# EasyEDA schematic PAPR_STM32F030F4_V1.json
TITLE: PAPR STM32F030F4; REV: 1.0; Date: 2020-04-01; Sheet: 1/1; Drawn By: Márk Péter Vargha; Company: NowTechnologies Ltd
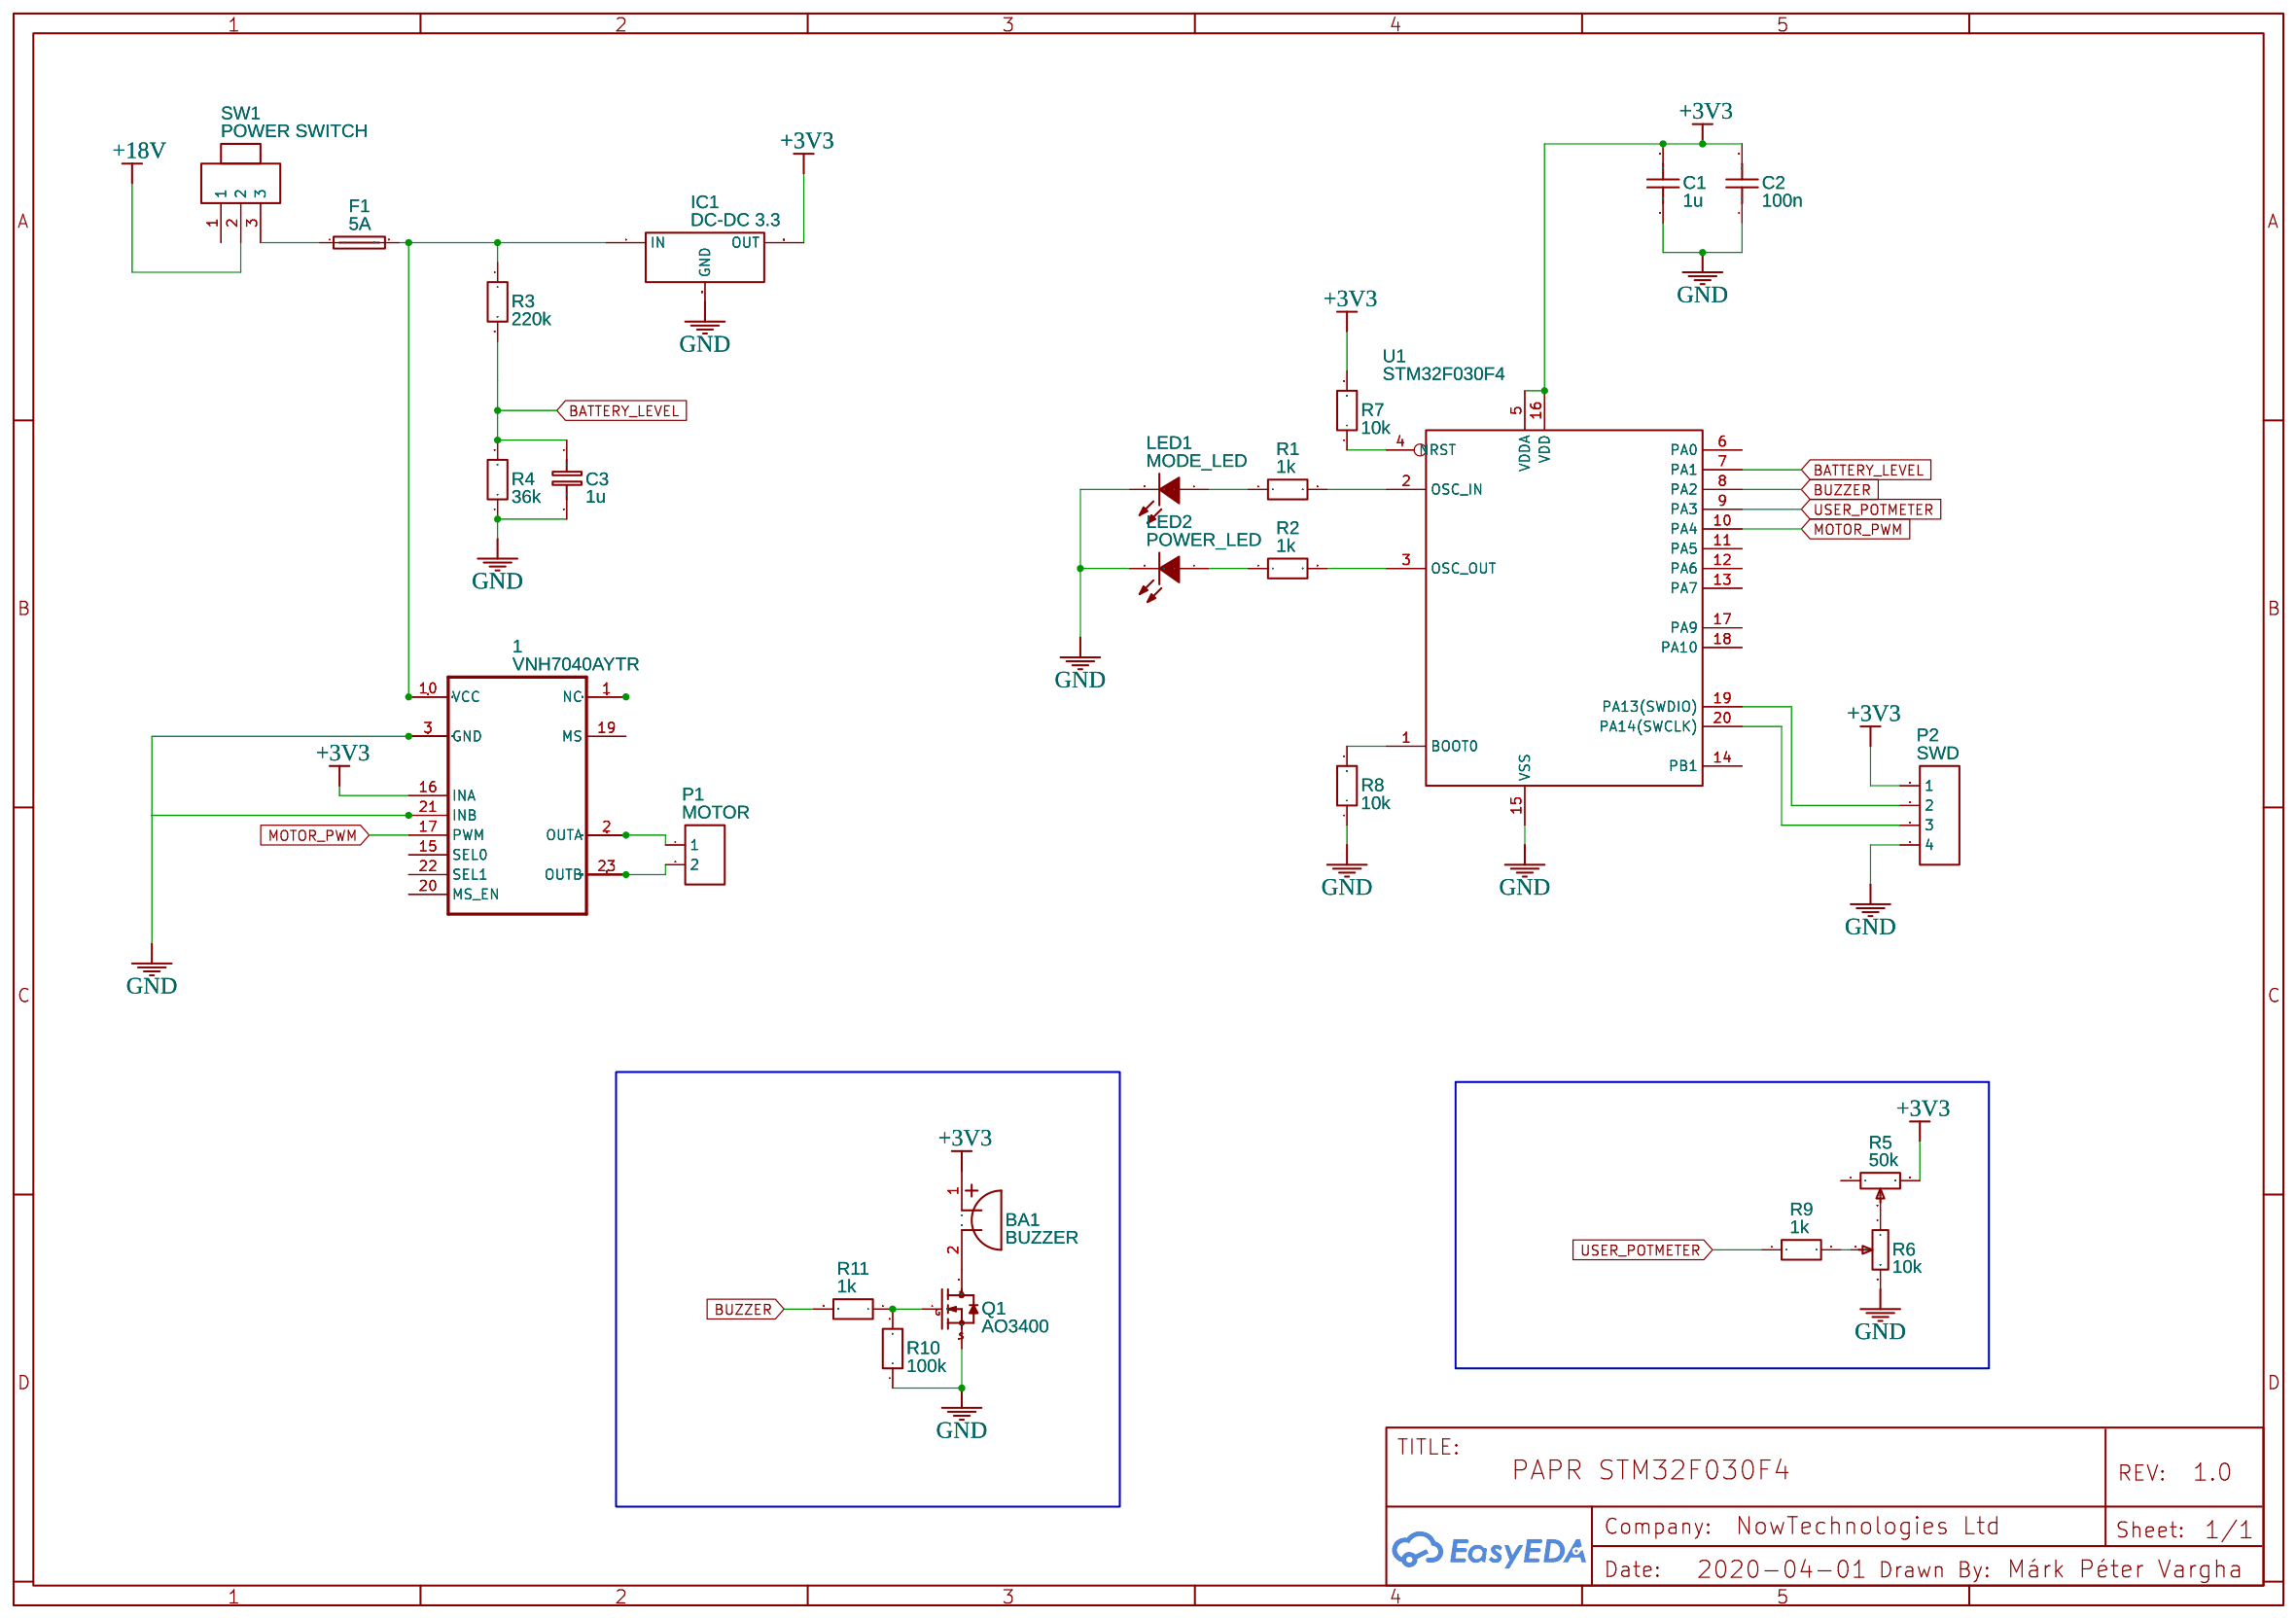
[diagram p0: schematic sheet]

## Parts
1  VNH7040AYTR  [POWERSSO-36]
BA1  BUZZER  [BEEPER_HC0905F_9.5X4.0MM]
C1  1u  [RAD-0.1]
C2  100n  [RAD-0.1]
C3  1u  [RAD-0.1]
F1  5A  [FUSE-SMD_5*20MM]
IC1  DC-DC 3.3  [AMS1117 3.3]
LED1  MODE_LED  [LED-3MM/2.54]
LED2  POWER_LED  [LED-3MM/2.54]
P1  MOTOR  [HDR-TH_2P-P2.54-V-M]
P2  SWD  [5268-4P]
Q1  AO3400  [SC-59-3_L2.9-W1.5-P0.95-LS2.5-BR]
R1  1k  [AXIAL-0.3]
R2  1k  [AXIAL-0.3]
R3  220k  [AXIAL-0.3]
R4  36k  [AXIAL-0.3]
R5  50k  [POTMETER]
R6  10k  [POTMETER]
R7  10k  [AXIAL-0.3]
R8  10k  [AXIAL-0.3]
R9  1k  [AXIAL-0.3]
R10  100k  [AXIAL-0.3]
R11  1k  [AXIAL-0.3]
SW1  POWER SWITCH  [601-10211BB-3P]
U1  STM32F030F4  [TSSOP-20]

## Library data of the parts
1 = VNH7040AYTR: Contributor: StanvanderVen
BA1 = 9X5.5_BEEPER_5V: Contributor: customyota
C1 = Cap_RAD-0.1_US
C2 = Cap_RAD-0.1_US: Package Display: No
C3 = Cap_RAD-0.1_EU
F1 = 5F 5A 250VACGlass tube fuse: Supplier: LCSC; Manufacturer: XCFuse; image: //image.lceda.cn/szlcsc/C3120.jpg; Supplier Part: C3120
IC1 = AMS1117 3.3: sourceId: OUgBz5nhN
LED1 LED2 = 204-10SURD/S530-A3: Supplier: LCSC; Manufacturer: EVERLIGHT; Supplier Part: C99772
P1 = Header-Female-2.54_1x2: Supplier: LCSC; Manufacturer: BOOMELE; Manufacturer Part: 2.54-1*2PFemale; image: //image.lceda.cn/szlcsc/C49661.jpg; Supplier Part: C49661
P2 = 4P: Contributor: kwang0621
Q1 = AO3400_C122850: Supplier: LCSC; Manufacturer: SK; Contributor: 立创EDA官方封装库; Supplier Part: C122850; LCSC Assembly: Yes; SMT Type: Extend
R1-R4 R7-R11 = Res_AXIAL-0.3(1/8W)_EU
R5 R6 = potmeter: Supplier: LCSC; Manufacturer: Bochen; Manufacturer Part: 3386P-1-101LF; Resistance(Ohms): 100; Supplier Part: C125022
SW1 = Rocker switch601-10211BB: Supplier: LCSC; Manufacturer: BBJ; image: //image.lceda.cn/szlcsc/C67849.jpg; Supplier Part: C67849
U1 = STM32F030F4: Contributor: eXtreme; sourceId: E0UO60izt

## Nets
+3V3: 1.16(INA) BA1.1 C1.2 C2.2 IC1.OUT P2.1 R5.3 R7.2 U1.5(VDDA) U1.16(VDD)
+18V: SW1.2
GND: 1.3(GND) 1.4(GND) 1.5(GND) 1.6(GND) 1.7(GND) 1.21(INB) 1.30(GND) 1.31(GND) 1.32(GND) 1.33(GND) 1.34(GND) C1.1 C2.1 C3.2 IC1.GND LED1.2(K) LED2.2(K) P2.4 Q1.2(S) R4.1 R6.3 R8.1 R10.1 U1.15(VSS)
BATTERY_LEVEL: C3.1 R3.2 R4.2 U1.7(PA1)
BUZZER: R11.2 U1.8(PA2)
MOTOR_PWM: 1.17(PWM) U1.10(PA4)
USER_POTMETER: R9.1 U1.9(PA3)
Net-(1-1): 1.1(NC) 1.18(NC) 1.36(NC)
Net-(1-2): 1.2(OUTA) 1.8(OUTA) 1.9(OUTA) 1.11(OUTA) 1.12(OUTA) 1.13(OUTA) 1.14(OUTA) 1.HS2(OUTA) P1.1
Net-(1-10): 1.10(VCC) 1.27(VCC) 1.HS1(VCC) F1.2 IC1.IN R3.1
Net-(1-23): 1.23(OUTB) 1.24(OUTB) 1.25(OUTB) 1.26(OUTB) 1.28(OUTB) 1.29(OUTB) 1.35(OUTB) 1.HS3(OUTB) P1.2
Net-(BA1-2): BA1.2 Q1.3(D)
Net-(F1-1): F1.1 SW1.3
Net-(LED1-1): LED1.1(A) R1.1
Net-(LED2-1): LED2.1(A) R2.1
Net-(P2-2): P2.2 U1.19(PA13(SWDIO))
Net-(P2-3): P2.3 U1.20(PA14(SWCLK))
Net-(Q1-1): Q1.1(G) R10.2 R11.1
Net-(R1-2): R1.2 U1.2(OSC_IN)
Net-(R2-2): R2.2 U1.3(OSC_OUT)
Net-(R5-2): R5.2 R6.1
Net-(R6-2): R6.2 R9.2
Net-(R7-1): R7.1 U1.4(NRST)
Net-(R8-2): R8.2 U1.1(BOOT0)

Not connected (* = marked no-connect by the designer): 1 15(SEL0) 19(MS) 20(MS_EN) 22(SEL1); R5 1; SW1 1; U1 6(PA0) 11(PA5) 12(PA6) 13(PA7) 14(PB1) 17(PA9) 18(PA10)
